# EasyEDA Pro project SMPS_V1.epro, schematic Schematic1
Board Name: Board1; Create Date: 2026-02-03; Page Name: HV PSU; Project Name: TL494-PSU-V1; Schematic Name: Schematic1; Update Date: 2026-02-26; Company: EasyEDA.com; Page Size: A4; Version: V1.0
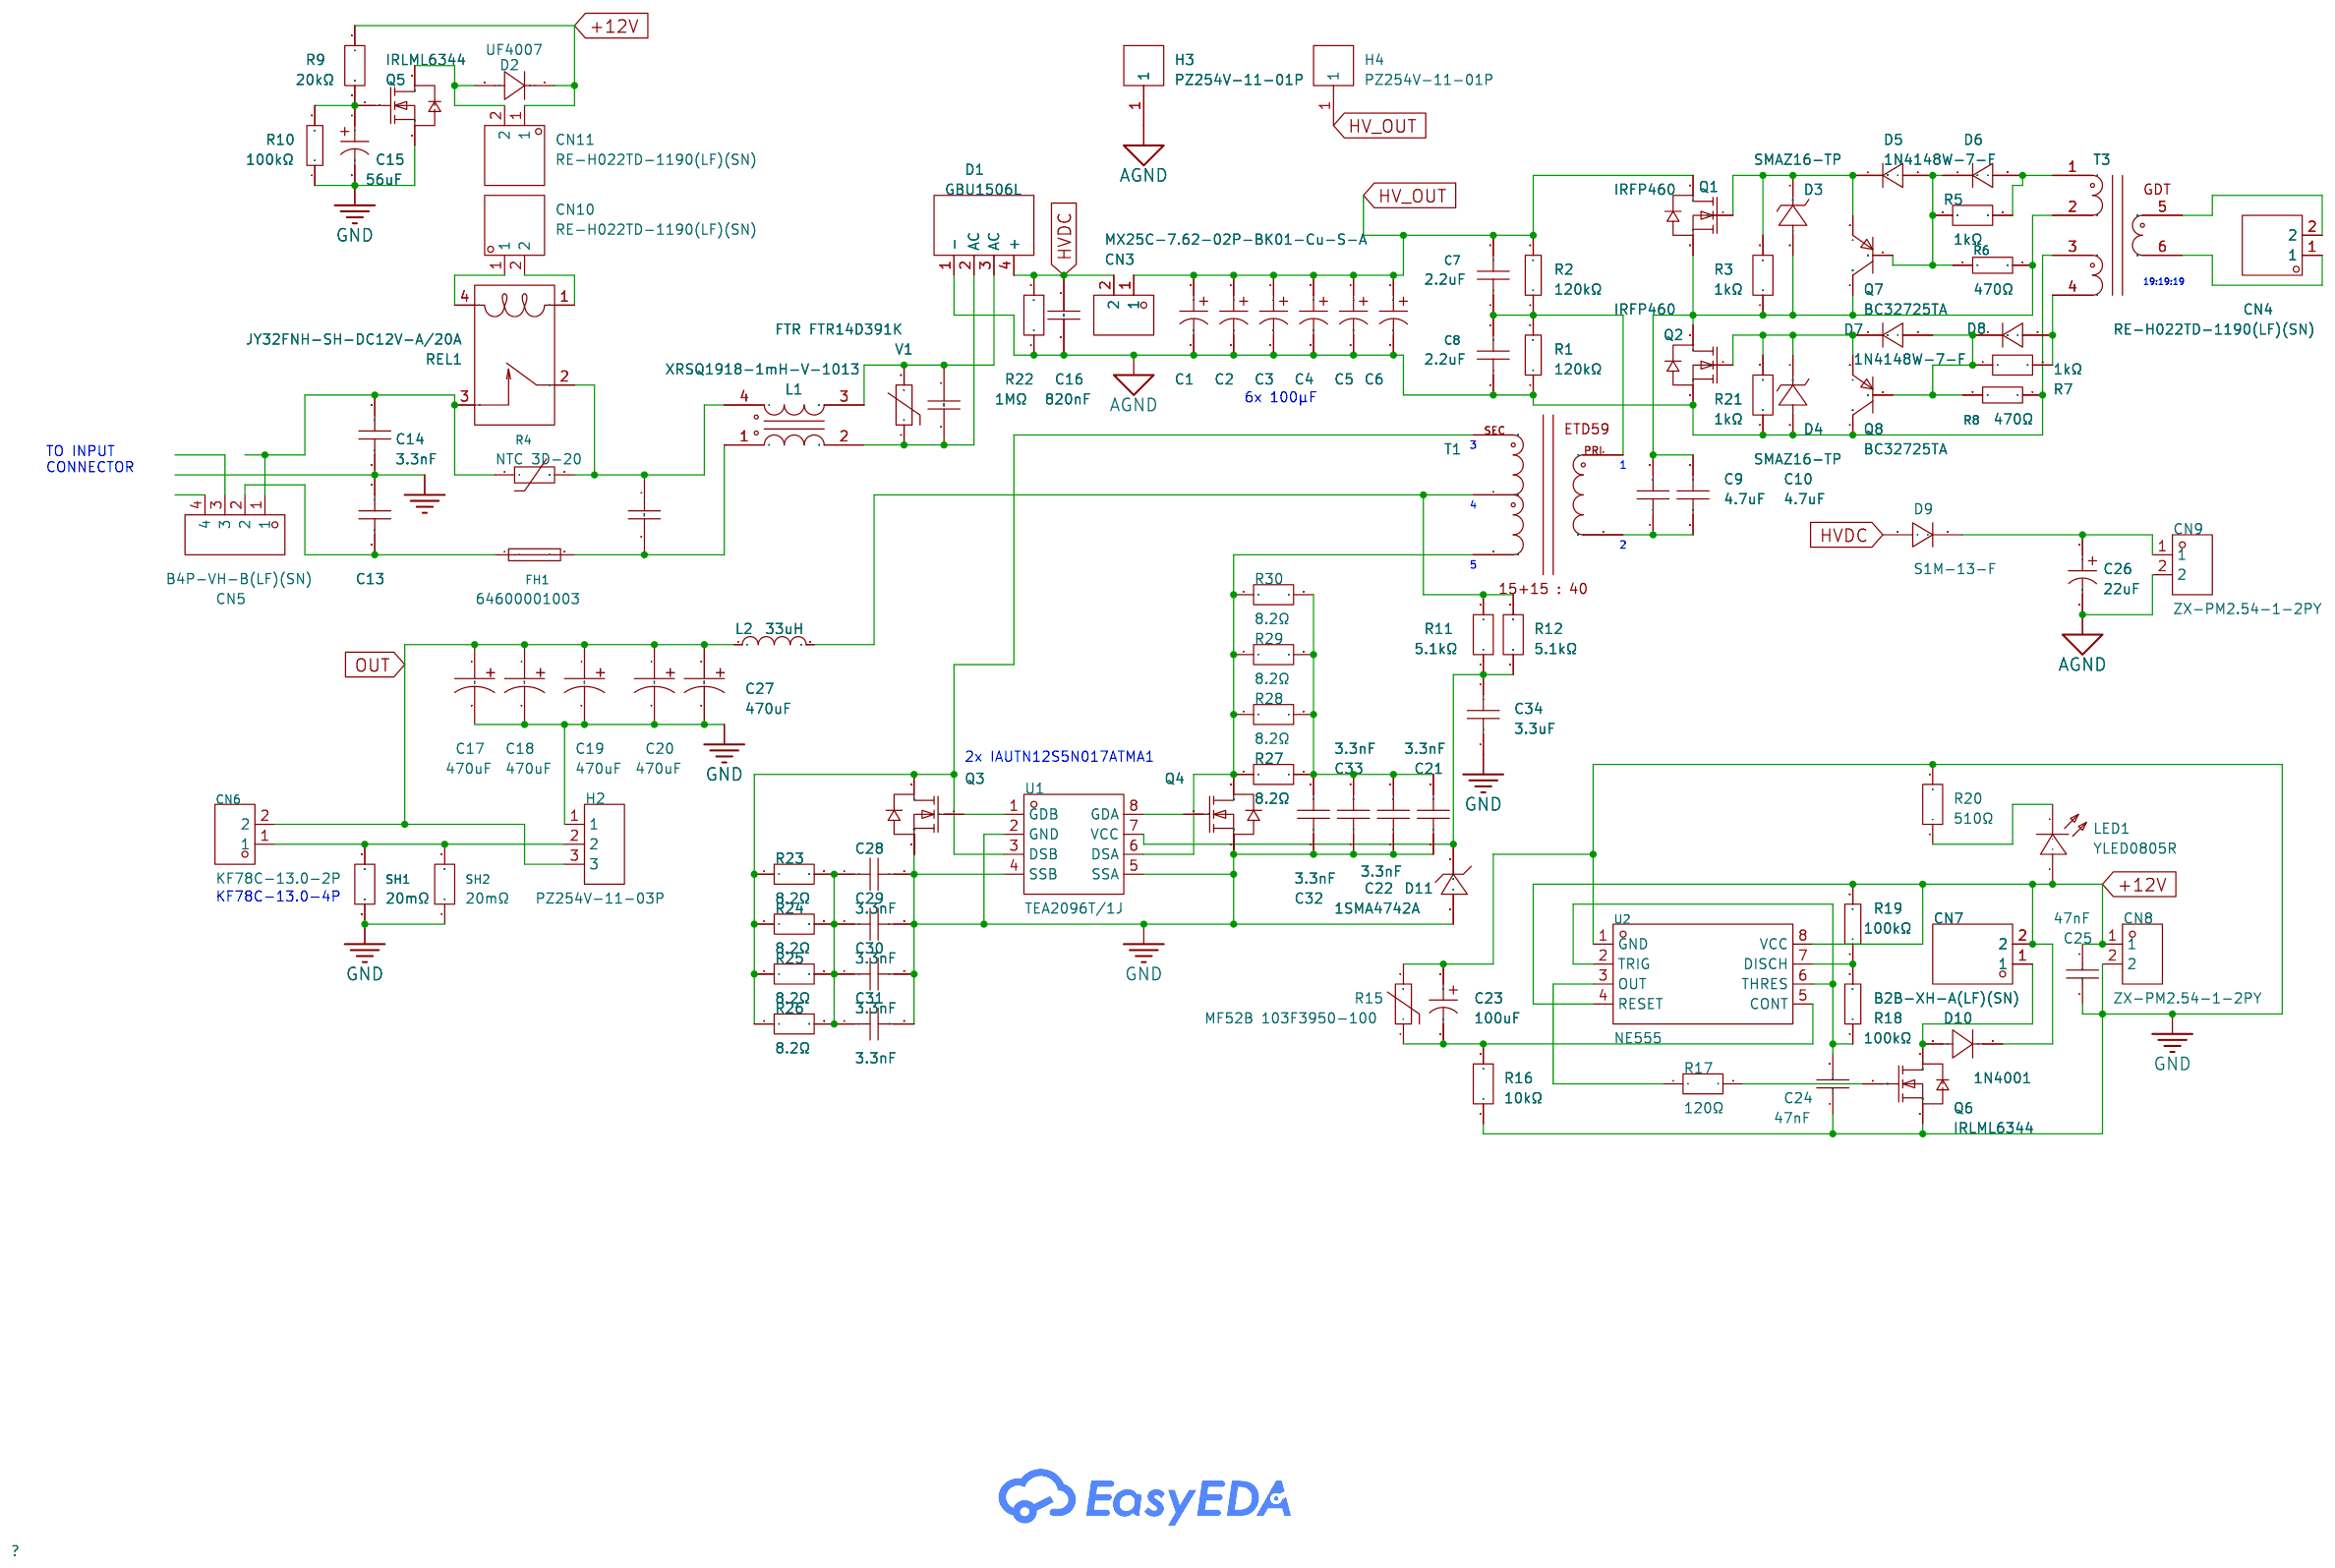
[diagram p1: schematic sheet]

## Parts
C1  100uF  [CAP-TH_BD12.5-P5.00-D0.6-FD]
C2  100uF  [CAP-TH_BD12.5-P5.00-D0.6-FD]
C3  100uF  [CAP-TH_BD12.5-P5.00-D0.6-FD]
C4  100uF  [CAP-TH_BD12.5-P5.00-D0.6-FD]
C5  100uF  [CAP-TH_BD12.5-P5.00-D0.6-FD]
C6  100uF  [CAP-TH_BD12.5-P5.00-D0.6-FD]
C7  2.2uF  [CAP-TH_L17.5-W11.1-P15.00-D1.2]
C8  2.2uF  [CAP-TH_L17.5-W11.1-P15.00-D1.2]
C9  4.7uF  [CAP-TH_L32.0-W15.0-P27.50-D0.8]
C10  4.7uF  [CAP-TH_L32.0-W15.0-P27.50-D0.8]
C11  330nF  [WALSON C42Q333446P40001]
C12  330nF  [WALSON C42Q333446P40001]
C13  3.3nF  [CAP-TH_L10.0-W4.4-P10.00-S3.8-D0.6]
C14  3.3nF  [CAP-TH_L10.0-W4.4-P10.00-S3.8-D0.6]
C15  56uF  [CAP-SMD_L7.3-W4.3-RD]
C16  820nF  [WALSON C42Q382446P60001]
C17  470uF  [CAP-TH_BD16.0-P7.50-D1.2-FD]
C18  470uF  [CAP-TH_BD16.0-P7.50-D1.2-FD]
C19  470uF  [CAP-TH_BD16.0-P7.50-D1.2-FD]
C20  470uF  [CAP-TH_BD16.0-P7.50-D1.2-FD]
C21  3.3nF  [C0805]
C22  3.3nF  [C0805]
C23  100uF  [CAP-SMD_BD6.3-L6.6-W6.6-LS7.4-FD]
C24  47nF  [C0603]
C25  47nF  [C0603]
C26  22uF  [CAP-TH_BD8.0-P3.50-D0.6-FD]
C27  470uF  [CAP-TH_BD16.0-P7.50-D1.2-FD]
C28  3.3nF  [C0805]
C29  3.3nF  [C0805]
C30  3.3nF  [C0805]
C31  3.3nF  [C0805]
C32  3.3nF  [C0805]
C33  3.3nF  [C0805]
C34  3.3uF  [C2220]
CN3  MX25C-7.62-02P-BK01-Cu-S-A  [CONN-TH_2P-P7.62_MAX_MX25C-7.62-BK01-02P-CU-S-A]
CN4  RE-H022TD-1190(LF)(SN)  [HDR-TH_2P-P2.54-V-M-1]
CN5  B4P-VH-B(LF)(SN)  [CONN-TH_4P-P3.96_B4P-VH-B-LF-SN]
CN6  KF78C-13.0-2P  [CONN-TH_KF78C-13.0-2P]
CN7  B2B-XH-A(LF)(SN)  [CONN-TH_B2B-XH-A-LF-SN]
CN8  ZX-PM2.54-1-2PY  [HDR-TH_2P-P2.54-V-F]
CN9  ZX-PM2.54-1-2PY  [HDR-TH_2P-P2.54-V-F]
CN10  RE-H022TD-1190(LF)(SN)  [HDR-TH_2P-P2.54-V-M-1]
CN11  RE-H022TD-1190(LF)(SN)  [HDR-TH_2P-P2.54-V-M-1]
D1  GBU1506L  [GBU_4P-L22.0-W3.5-P5.08]
D2  UF4007  [DO-41_BD2.4-L4.7-P8.70-D0.9-RD]
D3  SMAZ16-TP  [SMA_L4.3-W2.6-LS5.1-RD]
D4  SMAZ16-TP  [SMA_L4.3-W2.6-LS5.1-RD]
D5  1N4148W-7-F  [SOD-123_L2.7-W1.6-LS3.7-RD-1]
D6  1N4148W-7-F  [SOD-123_L2.7-W1.6-LS3.7-RD-1]
D7  1N4148W-7-F  [SOD-123_L2.7-W1.6-LS3.7-RD-1]
D8  1N4148W-7-F  [SOD-123_L2.7-W1.6-LS3.7-RD-1]
D9  S1M-13-F  [SMA_L4.3-W2.6-LS5.2-RD]
D10  1N4001  [SMA_L4.2-W2.6-LS5.0-RD]
D11  1SMA4742A  [SMA_L4.4-W2.8-LS5.4-RD]
FH1  64600001003  [64600001003]
H2  PZ254V-11-03P  [HDR-TH_3P-P2.54-V-M_PZ254V-11-03P]
H3  PZ254V-11-01P  [HDR-TH_1P-P2.54-V-M]
H4  PZ254V-11-01P  [HDR-TH_1P-P2.54-V-M]
L1  XRSQ1918-1mH-V-1013  [FILTER-TH_XRSQ1918-20MH-V-1013]
L2  33uH  [IND-TH_RSEQ32-20UH-47UH]
LED1  YLED0805R  [LED0805-R-RD_RED]
Q1  IRFP460  [TO-247-3_L15.9-W5.1-P5.44-L]
Q2  IRFP460  [TO-247-3_L15.9-W5.1-P5.44-L]
Q3  IAUTN12S5N017ATMA1  [PG-HSOF-8-1_L10.4-W9.9-P1.20-LS11.7-TL]
Q4  IAUTN12S5N017ATMA1  [PG-HSOF-8-1_L10.4-W9.9-P1.20-LS11.7-TL]
Q5  IRLML6344  [SOT-23-3_L3.0-W1.7-P0.95-LS2.9-BR]
Q6  IRLML6344  [SOT-23-3_L3.0-W1.7-P0.95-LS2.9-BR]
Q7  BC32725TA  [TO-92-3_L4.8-W3.7-P2.54-L]
Q8  BC32725TA  [TO-92-3_L4.8-W3.7-P2.54-L]
R1  120kΩ  [RES-TH_BD3.5-L9.5-P13.50-D0.6]
R2  120kΩ  [RES-TH_BD3.5-L9.5-P13.50-D0.6]
R3  1kΩ  [R1206]
R4  NTC 3D-20  [RES-TH_L22.0-W7.0-P7.80-D1.2-S2.00]
R5  1kΩ  [R1206]
R6  470Ω  [R2010]
R7  1kΩ  [R1206]
R8  470Ω  [R2010]
R9  20kΩ  [R1206]
R10  100kΩ  [R1206]
R11  5.1kΩ  [R2512]
R12  5.1kΩ  [R2512]
R15  MF52B 103F3950-100  [RES-TH_BD3.0-P2.00-D0.3]
R16  10kΩ  [R1206]
R17  120Ω  [R1206]
R18  100kΩ  [R1206]
R19  100kΩ  [R1206]
R20  510Ω  [R1206]
R21  1kΩ  [R1206]
R22  1MΩ  [R1206]
R23  8.2Ω  [R2512]
R24  8.2Ω  [R2512]
R25  8.2Ω  [R2512]
R26  8.2Ω  [R2512]
R27  8.2Ω  [R2512]
R28  8.2Ω  [R2512]
R29  8.2Ω  [R2512]
R30  8.2Ω  [R2512]
REL1  JY32FNH-SH-DC12V-A/20A  [RELAY-TH_JY32FNH-S-DCXXV-A-10A]
SH1  20mΩ  [RES-TH_BD1.0-P5.00-D1.0]
SH2  20mΩ  [RES-TH_BD1.0-P5.00-D1.0]
T1  -  [ETD59 - 50A HPWR]  (no BOM)
T3  -  [GDT - HPWR SMPS V1]  (no BOM)
U1  TEA2096T/1J  [SOIC-8_L5.0-W4.0-P1.27-LS6.1-BL]
U2  NE555  [SOIC-8_L4.9-W3.9-P1.27-LS6.0-BL]
V1  -  [RES-TH_L14.0-W5.0-P7.50-D1.0-S2.00]

## Library data of the parts
C1-C6 = KCXL4502W101MF: Capacitance:100uF Tolerance:±20% Tolerance:±20% Voltage Rating:450V Diameter:12.5mm Height - Seated (Max):45mm; LCSC Part Name: 100uF ±20% 450V; Supplier Part: C19193642; Manufacturer: Ymin(永铭); Supplier Footprint: 插件,D12.5xL45mm; JLCPCB Part Class: Extended Part; Supplier: LCSC; Tolerance: ±20%; Voltage Rating: 450V; Diameter: 12.5mm; Height - Seated (Max): 45mm
C7 C8 = ECWFD2W225JC: Capacitance:2.2uF Tolerance:±5% Tolerance:±5% Voltage Rating:450V Operating Temperature:-40℃~+110℃ Operating Temperature:-40℃~+110℃; LCSC Part Name: 2.2uF ±5% 450V; Supplier Part: C178473; Manufacturer: PANASONIC(松下); Supplier Footprint: 插件,P=15mm; JLCPCB Part Class: Extended Part; Datasheet: https://item.szlcsc.com/datasheet/ECWFD2W225JC/189866.html; Supplier: LCSC; Tolerance: ±5%; Voltage Rating: 450V; Operating Temperature: -40℃~+110℃
C9 C10 = C352J475JBSC000: Capacitance:4.7uF Tolerance:±5% Tolerance:±5% Voltage Rating:630V Operating Temperature:-55℃~+105℃ Operating Temperature:-55℃~+105℃; LCSC Part Name: 4.7uF ±5% 630V; Supplier Part: C19189618; Manufacturer: faratronic(厦门法拉); Supplier Footprint: 插件,P=27.5mm; JLCPCB Part Class: Extended Part; Datasheet: https://item.szlcsc.com/datasheet/C352J475JBSC000/20418291.html; Supplier: LCSC; Tolerance: ±5%; Voltage Rating: 630V; Operating Temperature: -55℃~+105℃
C11 C12 = WALSON C42Q333446P40001: Manufacturer: WALSON; Supplier Part: C46638868; Supplier: LCSC; Datasheet: https://www.lcsc.com/datasheet/C46638868.pdf; Part Number: C42Q333446P40001
C13 C14 = CY1332ME1IEF48O2A2: Capacitance:3.3nF Tolerance:±20% Tolerance:±20% Voltage(AC):400V Ratings:Y1 safety certification:CQC；CUL；UL；ENEC；VDE Operating Temperature:-40℃~+125℃ Operating Temperature:-40℃~+125℃; LCSC Part Name: 等级:Y1 3300pF ±20% 400V; Supplier Part: C2761711; Manufacturer: Dersonic(德尔创); Supplier Footprint: 插件,P=10mm; JLCPCB Part Class: Extended Part; Datasheet: https://item.szlcsc.com/datasheet/CY1332ME1IEF48O2A2/2886458.html; Supplier: LCSC; Tolerance: ±20%; Voltage(AC): 400V; Ratings: Y1; safety certification: CQC；CUL；UL；ENEC；VDE; Operating Temperature: -40℃~+125℃
C15 = EEFCX1D560R: Capacitance:56uF Tolerance:±20% Tolerance:±20% Voltage Rating:20V Type:Polymer Diameter:7.3mm Height - Seated (Max):4.3mm Operating Temperature:-55℃~+105℃ Operating Temperature:-55℃~+105℃; LCSC Part Name: 56uF ±20% 20V; Supplier Part: C465937; Manufacturer: PANASONIC(松下); Supplier Footprint: SMD,D7.3xL4.3mm; JLCPCB Part Class: Extended Part; Datasheet: https://item.szlcsc.com/datasheet/EEFCX1D560R/471270.html; Supplier: LCSC; Tolerance: ±20%; Voltage Rating: 20V; Type: Polymer; Diameter: 7.3mm; Height - Seated (Max): 4.3mm; Operating Temperature: -55℃~+105℃
C16 = WALSON C42Q382446P60001: Height: 19mm; Manufacturer: WALSON; Manufacturer Part: C42Q382446P60001; Supplier: LCSC; Supplier Part: C46638880
C17-C20 C27 = ERS1KM471L25OT: Capacitance:470uF Tolerance:±20% Tolerance:±20% Voltage Rating:100V Ripple Current:- Equivalent Series Resistance(ESR):- Pin Spacing:- Diameter:16mm Height - Seated (Max):25mm Lifetime:- Operating Temperature:-40℃~+105℃ Operating Temperature:-40℃~+105℃; LCSC Part Name: 470uF ±20% 100V; Supplier Part: C721247; Manufacturer: AISHI(艾华集团); Supplier Footprint: 插件,D16xL25mm; JLCPCB Part Class: Extended Part; Datasheet: https://item.szlcsc.com/datasheet/ERS1KM471L25OT/764996.html; Supplier: LCSC; Tolerance: ±20%; Voltage Rating: 100V; Diameter: 16mm; Height - Seated (Max): 25mm; Operating Temperature: -40℃~+105℃
C21 C22 C28-C33 = C2012C0G2E332JT000N: Capacitance:3.3nF Tolerance:±5% Tolerance:±5% Voltage Rating:250V Temperature Coefficient:C0G; LCSC Part Name: 3.3nF ±5% 250V; Supplier Part: C43052556; Manufacturer: TDK; Supplier Footprint: 0805; JLCPCB Part Class: Extended Part; Supplier: LCSC; Tolerance: ±5%; Voltage Rating: 250V; Temperature Coefficient: C0G
C23 = RVT1E101M0605: Capacitance:100uF Tolerance:±20% Tolerance:±20% Voltage Rating:25V Ripple Current:78mA@120Hz Equivalent Series Resistance(ESR):- Diameter:6.3mm Height - Seated (Max):5.4mm Lifetime:2000hrs@105℃ Operating Temperature:-40℃~+105℃ Operating Temperature:-40℃~+; LCSC Part Name: 100uF ±20% 25V; Supplier Part: C2918360; Manufacturer: ROQANG(容强); Supplier Footprint: SMD,D6.3xL5.4mm; JLCPCB Part Class: Extended Part; Supplier: LCSC; Tolerance: ±20%; Voltage Rating: 25V; Ripple Current: 78mA@120Hz; Diameter: 6.3mm; Height - Seated (Max): 5.4mm; Lifetime: 2000hrs@105℃; Operating Temperature: -40℃~+105℃
C24 C25 = CL10B473KB8NNNC: Capacitance:47nF Tolerance:±10% Tolerance:±10% Voltage Rating:50V Temperature Coefficient:X7R; LCSC Part Name: 47nF ±10% 50V; Supplier Part: C1622; Manufacturer: SAMSUNG(三星); Supplier Footprint: 0603; JLCPCB Part Class: Basic Part; Datasheet: https://item.szlcsc.com/datasheet/CL10B473KB8NNNC/1974.html; Supplier: LCSC; Tolerance: ±10%; Voltage Rating: 50V; Temperature Coefficient: X7R
C26 = CD110226M2G0816VFL: Capacitance:22uF Voltage Rating:400V Ripple Current:100mA@120Hz Pin Spacing:3.5mm Diameter:8mm Height - Seated (Max):16mm Lifetime:2000hrs@105℃ Operating Temperature:-40℃~+105℃ Operating Temperature:-40℃~+105℃; LCSC Part Name: 22uF 400V; Supplier Part: C7499973; Manufacturer: HRK(鸿瑞凯电子); Supplier Footprint: 插件,D8xL16mm; JLCPCB Part Class: Extended Part; Datasheet: https://item.szlcsc.com/datasheet/CD110226M2G0816VFL/8575833.html; Supplier: LCSC; Voltage Rating: 400V; Ripple Current: 100mA@120Hz; Pin Spacing: 3.5mm; Diameter: 8mm; Height - Seated (Max): 16mm; Lifetime: 2000hrs@105℃; Operating Temperature: -40℃~+105℃
C34 = FS55X335K251EHG: Capacitance:3.3uF Tolerance:±10% Tolerance:±10% Voltage Rating:250V Temperature Coefficient:X7R; LCSC Part Name: 3.3uF ±10% 250V; Supplier Part: C22370027; Manufacturer: PSA(信昌电陶); Supplier Footprint: 2220; JLCPCB Part Class: Extended Part; Datasheet: https://item.szlcsc.com/datasheet/FS55X335K251EHG/23849131.html; Supplier: LCSC; Tolerance: ±10%; Voltage Rating: 250V; Temperature Coefficient: X7R
CN3 = MX25C-7.62-02P-BK01-Cu-S-A: Barrier Type:2-Side Pitch:7.62mm Number of Positions or Pins:1x2P Mounting Type:Straight Pin Location:Mid Terminal Number of Pins:2P Number of Rows:1 Number of PINs Per Row:2 Screw Specification:M3 Current Rating:15A Voltage Rating (Max):300V Wire Gauge -; LCSC Part Name: 7.62mm 1x2P 直插 中脚 排数:1 每排P数:2; Supplier Part: C5188509; Manufacturer: MAX(迈旭); Supplier Footprint: 插件,P=7.62mm; JLCPCB Part Class: Extended Part; Datasheet: https://item.szlcsc.com/datasheet/MX25C-7.62-02P-BK01-Cu-S-A/5862593.html; Supplier: LCSC; Barrier Type: 2-Side; Pitch: 7.62mm; Number of Positions or Pins: 1x2P; Mounting Type: Straight; Pin Location: Mid Terminal; Number of Pins: 2P; Number of Rows: 1; Number of PINs Per Row: 2; Screw Specification: M3; Current Rating: 15A; Voltage Rating (Max): 300V; Wire Gauge - AWG: 14~22; Wire Gauge - mm2: 1.5; Operating Temperature: -40℃~+105℃; Color: Black
CN4 CN10 CN11 = RE-H022TD-1190(LF)(SN): Pins Structure:1x2P Pitch:2.54mm Mounting Type:Through Hole Number of Pins:2P Number of Rows:1 Number of PINs Per Row:2 Current Rating:3A Contact Material:Brass Operating Temperature:-55℃~+125℃ Operating Temperature:-55℃~+125℃ Voltage Rating:250V Plastic; LCSC Part Name: 1x2P 间距:2.54mm 直插; Supplier Part: C160332; Manufacturer: JST; Supplier Footprint: 插件,P=2.54mm; JLCPCB Part Class: Extended Part; Datasheet: https://item.szlcsc.com/datasheet/RE-H022TD-1190(LF)(SN)/171712.html; Supplier: LCSC; Pins Structure: 1x2P; Pitch: 2.54mm; Mounting Type: Through Hole; Number of Pins: 2P; Number of Rows: 1; Number of PINs Per Row: 2; Current Rating: 3A; Contact Material: Brass; Operating Temperature: -55℃~+125℃; Voltage Rating: 250V; Plastic Material: PBT; Flame Retardant Rating: UL94V-0; Color: Black
CN5 = B4P-VH-B(LF)(SN): Pins Structure:1x4P Pitch:3.96mm Mounting Style:Direct Insert Reference Series:VH Number of Pins:4P Number of Rows:1 Number of PINs Per Row:4 Row Spacing:- Current Rating (Max):10A Contact Material:Brass Contact Plating:Tin Operating Temperature Range:-25; LCSC Part Name: 1x4P 间距:3.96mm 直插 系列:VH; Supplier Part: C493148; Manufacturer: JST; Supplier Footprint: 插件,P=3.96mm; JLCPCB Part Class: Extended Part; Datasheet: https://atta.szlcsc.com/upload/public/pdf/source/20220208/ECAA58BC68B23E29E576C700CFB0AF43.pdf; Supplier: LCSC; Pins Structure: 1x4P; Pitch: 3.96mm; Mounting Style: Direct Insert; Reference Series: VH; Number of Pins: 4P; Number of Rows: 1; Number of PINs Per Row: 4; Current Rating (Max): 10A; Contact Material: Brass; Contact Plating: Tin; Operating Temperature Range: -25℃~+85℃; Rated Voltage (Max): 250V; Plastic Material: Glass Fiber Reinforced PBT; Flame Retardant Rating: UL94V-0; Colour: White; Z-Height of the Board: 9.4mm; X-Length of Bottom Edge on Board (Spacing Line): 15.78mm; Y-Width of Bottom Edge on Board: 8.5mm
CN6 = KF78C-13.0-2P: Barrier Type:With Cover Plate Pitch:13mm Number of Positions or Pins:1x2P Mounting Type:Straight Pin Location:Mid Terminal Number of Pins:2P Number of Rows:1 Number of PINs Per Row:2 Current Rating:40A Voltage Rating (Max):750V Wire Gauge - AWG:10~18 Wire; LCSC Part Name: 13mm 1x2P 直插 中脚 排数:1 每排P数:2; Supplier Part: C707721; Manufacturer: KEFA(科发); Supplier Footprint: 插件,P=13mm; JLCPCB Part Class: Extended Part; Datasheet: https://item.szlcsc.com/datasheet/KF78C-13.0-2P/744930.html; Supplier: LCSC; Barrier Type: With Cover Plate; Pitch: 13mm; Number of Positions or Pins: 1x2P; Mounting Type: Straight; Pin Location: Mid Terminal; Number of Pins: 2P; Number of Rows: 1; Number of PINs Per Row: 2; Current Rating: 40A; Voltage Rating (Max): 750V; Wire Gauge - AWG: 10~18; Wire Gauge - mm2: 6; Operating Temperature: -40℃~+105℃; Color: Black
CN7 = B2B-XH-A(LF)(SN): Pins Structure:1x2P Pitch:2.5mm Mounting Type:Through Hole Reference Series:XH Number of Pins:2P Number of Rows:1 Number of PINs Per Row:2 Row Spacing:- Current Rating:3A Contact Material:Brass Contact Plating:Tin Operating Temperature:-25℃~+85℃ Operating; LCSC Part Name: 1x2P 间距:2.5mm 直插 系列:XH; Supplier Part: C158012; Manufacturer: JST; Supplier Footprint: 插件,P=2.5mm; JLCPCB Part Class: Extended Part; Datasheet: https://item.szlcsc.com/datasheet/B2B-XH-A(LF)(SN)/169360.html; Supplier: LCSC; Pins Structure: 1x2P; Pitch: 2.5mm; Mounting Type: Through Hole; Reference Series: XH; Number of Pins: 2P; Number of Rows: 1; Number of PINs Per Row: 2; Current Rating: 3A; Contact Material: Brass; Contact Plating: Tin; Operating Temperature: -25℃~+85℃; Voltage Rating: 250V; Plastic Material: PA66; Flame Retardant Rating: UL94V-0; Supplementary Features: K Pin; Color: White; Z-Height of the Board: 7mm; X-Length of Bottom Edge on Board (Spacing Line): 7.4mm; Y-Width of Bottom Edge on Board: 5.75mm
CN8 CN9 = ZX-PM2.54-1-2PY: Holes Structure:1x2P Pitch:2.54mm Row Spacing:- Circular Hole / Square Hole:Square Hole Mounting Type:Through Hole Number of Rows:1 Number of Positions:2P Current Rating:3A Voltage Rating (Max):- Holes Direction:Top Insulation Height:8.5mm Contact Materia; LCSC Part Name: 1x2P 间距:2.54mm 直插; Supplier Part: C7499322; Manufacturer: Megastar(兆星); Supplier Footprint: 插件,P=2.54mm; JLCPCB Part Class: Extended Part; Datasheet: https://item.szlcsc.com/datasheet/ZX-PM2.54-1-2PY/8573983.html; Supplier: LCSC; Holes Structure: 1x2P; Pitch: 2.54mm; Circular Hole / Square Hole: Square Hole; Mounting Type: Through Hole; Number of Rows: 1; Number of Positions: 2P; Current Rating: 3A; Holes Direction: Top; Insulation Height: 8.5mm; Contact Material: Brass; Contact Plating: Gold; Operating Temperature: -40℃~+105℃; PIN Length: 3.2mm
D1 = GBU1510_C350460: Forward Voltage (Vf@If):900mV@15A Reverse Voltage (Vr): Rectified Current: Reverse Leakage Current (Ir):5uA@600V Peak Forward Surge Current: Operating Temperature:-55℃~+150℃@(Tj) Operating Temperature:-55℃~+150℃@(Tj); Supplier Part: C49326439; Manufacturer: XUMAO; Supplier Footprint: GBU; JLCPCB Part Class: Extended Part; Datasheet: https://atta.szlcsc.com/upload/public/pdf/source/20190115/C350460_808B5E29F59959D047D79C3B6590DA46.pdf; Supplier: LCSC; Forward Voltage (Vf@If): 900mV@15A; Reverse Leakage Current (Ir): 5uA@600V; Operating Temperature: -55℃~+150℃
D2 = UF4007_C960666: Diode Configuration:- Voltage - Forward(Vf@If):1.7V@1A Voltage - DC Reverse(Vr):1kV Current - Rectified:1A Reverse Leakage Current (Ir):5uA@1kV Reverse Recovery Time (trr):75ns Operating Junction Temperature Range:-50℃~+150℃@(Tj) Operating Junction Temper; LCSC Part Name: 耐压:1kV 电流:1A 反向恢复时间：75ns; Supplier Part: C960666; Manufacturer: MDD(辰达半导体); Supplier Footprint: DO-41; JLCPCB Part Class: Extended Part; Datasheet: https://item.szlcsc.com/datasheet/UF4007/1039942.html; Supplier: LCSC; Voltage - Forward(Vf@If): 1.7V@1A; Voltage - DC Reverse(Vr): 1kV; Current - Rectified: 1A; Reverse Leakage Current (Ir): 5uA@1kV; Reverse Recovery Time (trr): 75ns; Operating Junction Temperature Range: -50℃~+150℃@(Tj); Non-Repetitive Peak Forward Surge Current: 30A
D3 D4 = SMAZ16-TP_C49274893: Diode Configuration:1 Independent Zener Voltage(Nom):16V Reverse Leakage Current (Ir):1uA@12.2V Zener Voltage(Range):15.2V~16.8V Zener Voltage(Range):15.2V~16.8V Pd - Power Dissipation:1.5W Impedance(Zzt):10Ω Operating Junction Temperature Range:-55℃~+150; LCSC Part Name: 16V 1uA@12.2V; Supplier Part: C49274893; Manufacturer: TECH PUBLIC(台舟); Supplier Footprint: SMA; JLCPCB Part Class: Extended Part; Datasheet: https://item.szlcsc.com/datasheet/SMAZ16-TP/51722914.html; Supplier: LCSC; Diode Configuration: 1 Independent; Zener Voltage(Nom): 16V; Reverse Leakage Current (Ir): 1uA@12.2V; Zener Voltage(Range): 15.2V~16.8V; Pd - Power Dissipation: 1.5W; Impedance(Zzt): 10Ω; Operating Junction Temperature Range: -55℃~+150℃
D5-D8 = 1N4148W-7-F: Diode Configuration:Independent Voltage - Forward(Vf@If):1.25V@150mA Voltage - DC Reverse(Vr):100V Current - Rectified:300mA Pd - Power Dissipation:400mW Reverse Leakage Current (Ir):1uA@75V Reverse Recovery Time (trr):4ns Operating Junction Temperature R; LCSC Part Name: 100V 300mA; Supplier Part: C83528; Manufacturer: DIODES(美台); Supplier Footprint: SOD-123; JLCPCB Part Class: Extended Part; Datasheet: https://item.szlcsc.com/datasheet/1N4148W-7-F/84693.html; Supplier: LCSC; Diode Configuration: Independent; Voltage - Forward(Vf@If): 1.25V@150mA; Voltage - DC Reverse(Vr): 100V; Current - Rectified: 300mA; Pd - Power Dissipation: 400mW; Reverse Leakage Current (Ir): 1uA@75V; Reverse Recovery Time (trr): 4ns; Operating Junction Temperature Range: -65℃~+150℃@(Tj); Non-Repetitive Peak Forward Surge Current: 2A
D9 = S1M-13-F: Diode Configuration: Forward Voltage (Vf@If):1.1V@1A Reverse Voltage (Vr): Rectified Current: Reverse Leakage Current:5uA@1kV; LCSC Part Name: 电压:1kV 电流:1A; Supplier Part: C155378; Manufacturer: DIODES(美台); Supplier Footprint: SMA(DO-214AC); JLCPCB Part Class: Extended Part; Datasheet: https://atta.szlcsc.com/upload/public/pdf/source/20191127/C460934_53CB09884FCCA0C915B3DA89ED1AF032.pdf; Supplier: LCSC; Forward Voltage (Vf@If): 1.1V@1A; Reverse Leakage Current: 5uA@1kV
D10 = 1N4001_C2909965: Diode Configuration:Independent Voltage - Forward(Vf@If):1.1V@1A Voltage - DC Reverse(Vr):50V Current - Rectified:1A Reverse Leakage Current (Ir):5uA@50V Non-Repetitive Peak Forward Surge Current:30A Operating Junction Temperature Range:-55℃~+150℃ Operati; Supplier Part: C2909965; Manufacturer: YONGYUTAI(永裕泰); Supplier Footprint: SMA; JLCPCB Part Class: Extended Part; Datasheet: https://item.szlcsc.com/datasheet/1N4001/3188906.html; Supplier: LCSC; Diode Configuration: Independent; Voltage - Forward(Vf@If): 1.1V@1A; Voltage - DC Reverse(Vr): 50V; Current - Rectified: 1A; Reverse Leakage Current (Ir): 5uA@50V; Non-Repetitive Peak Forward Surge Current: 30A; Operating Junction Temperature Range: -55℃~+150℃
D11 = 1SMA4742A_C173481: Diode Configuration:Independent Zener Voltage(Nom):12V Reverse Leakage Current (Ir):5uA Zener Voltage(Range):11.4V~12.6V Zener Voltage(Range):11.4V~12.6V Pd - Power Dissipation:1W Impedance(Zzt):9Ω Operating Junction Temperature Range:-55℃~+150℃ Operating; Supplier Part: C173481; Manufacturer: MDD(辰达半导体); Supplier Footprint: SMA(DO-214AC); JLCPCB Part Class: Extended Part; Datasheet: https://item.szlcsc.com/datasheet/1SMA4742A/184870.html; Supplier: LCSC; Diode Configuration: Independent; Zener Voltage(Nom): 12V; Reverse Leakage Current (Ir): 5uA; Zener Voltage(Range): 11.4V~12.6V; Pd - Power Dissipation: 1W; Impedance(Zzt): 9Ω; Operating Junction Temperature Range: -55℃~+150℃
FH1 = 64600001003: Fuseholder Type:Bracket type Number of Circuits:1 Voltage Rating:250V Current Rating:6.3A Fuse Type:Cylindrical Fuse Diameter (φD):5mm Fuse Length:20mm; LCSC Part Name: 6.3A 250V 支座型; Supplier Part: C206887; Manufacturer: Littelfuse(美国力特); Supplier Footprint: 插件; JLCPCB Part Class: Extended Part; Datasheet: https://item.szlcsc.com/datasheet/64600001003/208006.html; Supplier: LCSC; Fuseholder Type: Bracket type; Number of Circuits: 1; Voltage Rating: 250V; Current Rating: 6.3A; Fuse Type: Cylindrical; Fuse Diameter (φD): 5mm; Fuse Length: 20mm
H2 = PZ254V-11-03P: Pin Structure:1x3P Pitch:2.54mm Row Spacing:- Circluar Pins/Square Pins:Pin Header Mounting Type:Through Hole Number of Rows:1 Number of Pins:3P Current Rating:3A Voltage Rating (Max):250V Length of Mating Pin:6mm Insulation Height:2.5mm Length of End Con; LCSC Part Name: 1x3P 间距:2.54mm 方针 直插; Supplier Part: C2937625; Manufacturer: XFCN(兴飞); Supplier Footprint: 插件,P=2.54mm; JLCPCB Part Class: Extended Part; Datasheet: https://item.szlcsc.com/datasheet/PZ254V-11-03P/3293280.html; Supplier: LCSC; Pin Structure: 1x3P; Pitch: 2.54mm; Circluar Pins/Square Pins: Pin Header; Mounting Type: Through Hole; Number of Rows: 1; Number of Pins: 3P; Current Rating: 3A; Voltage Rating (Max): 250V; Length of Mating Pin: 6mm; Insulation Height: 2.5mm; Length of End Connection Pin: 3mm; Operating Temperature: -40℃~+105℃; Color: Black
H3 H4 = PZ254V-11-01P: Pin Structure:1x1P Pitch:2.54mm Row Spacing:- Circluar Pins/Square Pins:Pin Header Mounting Type:Through Hole Number of Rows:1 Number of Pins:1P Current Rating:- Voltage Rating (Max):- Length of Mating Pin:6mm Insulation Height:2.5mm Length of End Connect; LCSC Part Name: 1x1P 间距:2.54mm 方针 直插; Supplier Part: C492400; Manufacturer: XFCN(兴飞); Supplier Footprint: 插件,P=2.54mm; JLCPCB Part Class: Extended Part; Datasheet: https://item.szlcsc.com/datasheet/PZ254V-11-01P/502956.html; Supplier: LCSC; Pin Structure: 1x1P; Pitch: 2.54mm; Circluar Pins/Square Pins: Pin Header; Mounting Type: Through Hole; Number of Rows: 1; Number of Pins: 1P; Length of Mating Pin: 6mm; Insulation Height: 2.5mm; Length of End Connection Pin: 3mm; Contact Material: Brass; Operating Temperature: -40℃~+105℃; Color: Black
L1 = XRSQ1918-1mH-V-1013: Number of Lines:2 Voltage Withstand:1.5kV Current Rating:10A Inductance @ Frequency:1mH@1kHZ DC Resistance(DCR):20mΩ; LCSC Part Name: SQ1918-1mH  立式 13*10  0.7* 1.5线; Supplier Part: C41368814; Manufacturer: XR(祥如); Supplier Footprint: 插件-4P,24x15mm; JLCPCB Part Class: Extended Part; Datasheet: https://item.szlcsc.com/datasheet/XRSQ1918-1mH-V-1013/43126304.html; Supplier: LCSC; Number of Lines: 2; Voltage Withstand: 1.5kV; Current Rating: 10A; Inductance @ Frequency: 1mH@1kHZ; DC Resistance(DCR): 20mΩ
L2 = RSEQ32-330M: Inductance:33uH Tolerance:±20% Tolerance:±20% Current Rating:40A Current - Saturation(Isat):42A DC Resistance(DCR):0.9mΩ Type:Flat Wire Inductor; LCSC Part Name: 扁线大电流电感; Supplier Part: C37634009; Manufacturer: Ruishen(瑞申电子); Supplier Footprint: 插件,33x31.5mm; JLCPCB Part Class: Extended Part; Datasheet: https://item.szlcsc.com/datasheet/RSEQ32-330M/39358272.html; Supplier: LCSC; Tolerance: ±20%; Current Rating: 40A; Current - Saturation(Isat): 42A; DC Resistance(DCR): 0.9mΩ; Type: Flat Wire Inductor
LED1 = YLED0805R: Emitted Color:Red Forward Voltage (VF):1.8V~2.4V Forward Voltage (VF):1.8V~2.4V Power Dissipation:60mW Forward Current:20mA Dominant Wavelength:615nm~630nm Dominant Wavelength:615nm~630nm Peak Wavelength:645nm Diode Configuration:- Lens Color:- Color Temp; Supplier Part: C19171391; Manufacturer: YONGYUTAI(永裕泰); Supplier Footprint: 0805; JLCPCB Part Class: Extended Part; Datasheet: https://atta.szlcsc.com/upload/public/pdf/source/20231027/AB486D22E6D71BC59190C48A798367E6.pdf; Supplier: LCSC; Emitted Color: Red; Forward Voltage (VF): 1.8V~2.4V; Power Dissipation: 60mW; Forward Current: 20mA; Dominant Wavelength: 615nm~630nm; Peak Wavelength: 645nm; Operating Temperature: -40℃~+85℃
Q1 Q2 = IRFP460_C22389973: LCSC Part Name: N沟道20A 500V; Supplier Part: C22389973; Manufacturer: minos(迈诺斯); Supplier Footprint: TO-247; JLCPCB Part Class: Extended Part; Datasheet: https://atta.szlcsc.com/upload/public/pdf/source/20240425/7FEF0AD281DA18A3AE3A6EE2E867B3B9.pdf; Supplier: LCSC
Q3 Q4 = IAUTN12S5N017ATMA1: Drain to Source Voltage:120V Current - Continuous Drain(Id):314A RDS(on):1.7mΩ@10V Pd - Power Dissipation:358W Gate Threshold Voltage (Vgs(th)):3.6V@270uA Gate Charge(Qg):145nC@10V Input Capacitance(Ciss):10.74nF Reverse Transfer Capacitance (Crss@Vds):68; LCSC Part Name: OptiMos 5 汽车级功率 MOSFET，120 V; Supplier Part: C20190989; Manufacturer: Infineon(英飞凌); Supplier Footprint: HSOF-8-1; JLCPCB Part Class: Extended Part; Datasheet: https://item.szlcsc.com/datasheet/IAUTN12S5N017ATMA1/21516986.html; Supplier: LCSC; Drain to Source Voltage: 120V; Current - Continuous Drain(Id): 314A; RDS(on): 1.7mΩ@10V; Pd - Power Dissipation: 358W; Gate Threshold Voltage (Vgs(th)): 3.6V@270uA; Gate Charge(Qg): 145nC@10V; Input Capacitance(Ciss): 10.74nF; Reverse Transfer Capacitance (Crss@Vds): 68pF; Type: N-Channel; Output Capacitance(Coss): 3.08nF
Q5 Q6 = IRLML6344: Number:One N-channel Drain to Source Voltage:30V Current - Continuous Drain(Id):5A RDS(on):29mΩ@4.5V,5A Pd - Power Dissipation:1.3W Gate Threshold Voltage (Vgs(th)):1.1V Gate Charge(Qg):6.8nC@4.5V Input Capacitance(Ciss):650pF@25V Reverse Transfer Capacit; LCSC Part Name: 1个N沟道 耐压:30V 电流:5A; Supplier Part: C5364313; Manufacturer: Hottech(合科泰); Supplier Footprint: SOT-23; JLCPCB Part Class: Extended Part; Datasheet: https://item.szlcsc.com/datasheet/IRLML6344/6193391.html; Supplier: LCSC; Number: One N-channel; Drain to Source Voltage: 30V; Current - Continuous Drain(Id): 5A; RDS(on): 29mΩ@4.5V,5A; Pd - Power Dissipation: 1.3W; Gate Threshold Voltage (Vgs(th)): 1.1V; Gate Charge(Qg): 6.8nC@4.5V; Input Capacitance(Ciss): 650pF@25V; Reverse Transfer Capacitance (Crss@Vds): 46pF@15V; Operating Temperature: -55℃~+150℃
Q7 Q8 = BC32725TA: type:PNP Current - Collector(Ic):800mA Collector - Emitter Voltage VCEO:45V Pd - Power Dissipation:625mW DC Current Gain:100@100mA,1V DC Current Gain:100@100mA,1V Transition frequency(fT):100MHz Current - Collector Cutoff:100nA Vce Saturation(VCE(sat)):70; LCSC Part Name: PNP 电流:800mA 电压:45V; Supplier Part: C236948; Manufacturer: onsemi(安森美); Supplier Footprint: TO-92-3L; JLCPCB Part Class: Extended Part; Datasheet: https://item.szlcsc.com/datasheet/BC32725TA/236375.html; Supplier: LCSC; type: PNP; Current - Collector(Ic): 800mA; Collector - Emitter Voltage VCEO: 45V; Pd - Power Dissipation: 625mW; DC Current Gain: 100@100mA,1V; Transition frequency(fT): 100MHz; Current - Collector Cutoff: 100nA; Vce Saturation(VCE(sat)): 700mV@500mA,50mA; Operating Temperature: -55℃~+150℃; Emitter-Base Voltage(Vebo): 5V; Number: 1 PNP
R1 R2 = MO1WS-120K±5%-2T52: Type:Metal Oxide Film Resistor Resistance:120kΩ Tolerance:±5% Tolerance:±5% Voltage-Supply(Max):350V Power(Watts):1W Temperature Coefficient:±350ppm/℃ Temperature Coefficient:±350ppm/℃ Operating Temperature:-55℃~+155℃ Operating Temperature:-55℃~+155℃; LCSC Part Name: 金属氧化膜电阻 120kΩ ±5% 1W; Supplier Part: C479440; Manufacturer: VO(翔胜); Supplier Footprint: 插件,D3.5xL9mm; JLCPCB Part Class: Extended Part; Datasheet: https://item.szlcsc.com/datasheet/MO1WS-120K%25C2%25B15%2525-2T52/486809.html; Supplier: LCSC; Type: Metal Oxide Film Resistor; Tolerance: ±5%; Voltage-Supply(Max): 350V; Power(Watts): 1W; Temperature Coefficient: ±350ppm/℃; Operating Temperature: -55℃~+155℃
R3 R5 R7 R21 = ERJ-P08F1001V: Type:Thick Film Resistor Resistance:1kΩ Tolerance:±1% Tolerance:±1% Power(Watts):660mW Voltage-Supply(Max):500V Temperature Coefficient:±100ppm/℃ Temperature Coefficient:±100ppm/℃ Operating Temperature:-55℃~+155℃ Operating Temperature:-55℃~+155℃; LCSC Part Name: 1kΩ ±1% 660mW 厚膜电阻; Supplier Part: C4261071; Manufacturer: PANASONIC(松下); Supplier Footprint: 1206; JLCPCB Part Class: Extended Part; Datasheet: https://item.szlcsc.com/datasheet/ERJ-P08F1001V/4831500.html; Supplier: LCSC; Type: Thick Film Resistor; Tolerance: ±1%; Power(Watts): 660mW; Voltage-Supply(Max): 500V; Temperature Coefficient: ±100ppm/℃; Operating Temperature: -55℃~+155℃
R4 = NTC 3D-20: Resistance @ 25℃:3Ω B Constant (25℃/50℃):2700K B Constant (25℃/75℃):2700K B Constant (25℃/85℃):2700K B Constant (25℃/100℃):2700K Power(Watts):4W B Constant Tolerance:±10% Steady State Current (Max):8A Operating Temperature:-40℃~+200℃ Operating Temperature; Supplier Part: C2841043; Manufacturer: RUILON(瑞隆源); Supplier Footprint: 插件,P=10mm; JLCPCB Part Class: Extended Part; Datasheet: https://item.szlcsc.com/datasheet/NTC%25203D-20/3022351.html; Supplier: LCSC; Resistance @ 25℃: 3Ω; B Constant (25℃/50℃): 2700K; B Constant (25℃/75℃): 2700K; B Constant (25℃/85℃): 2700K; B Constant (25℃/100℃): 2700K; Power(Watts): 4W; B Constant Tolerance: ±10%; Steady State Current (Max): 8A; Operating Temperature: -40℃~+200℃
R6 R8 = RTT20471JTE: Type:Thick Film Resistor Resistance:470Ω Tolerance:±5% Tolerance:±5% Power(Watts):750mW Voltage-Supply(Max):200V Temperature Coefficient:±100ppm/℃ Temperature Coefficient:±100ppm/℃ Operating Temperature:-55℃~+155℃ Operating Temperature:-55℃~+155℃; LCSC Part Name: 厚膜电阻 470Ω ±5% 750mW; Supplier Part: C333406; Manufacturer: RALEC(旺诠); Supplier Footprint: 2010; JLCPCB Part Class: Extended Part; Datasheet: https://item.szlcsc.com/datasheet/RTT20471JTE/312182.html; Supplier: LCSC; Type: Thick Film Resistor; Tolerance: ±5%; Power(Watts): 750mW; Voltage-Supply(Max): 200V; Temperature Coefficient: ±100ppm/℃; Operating Temperature: -55℃~+155℃
R9 = FRC1206F2002TS: Type:Thick Film Resistor Resistance:20kΩ Tolerance:±1% Tolerance:±1% Power(Watts):250mW Voltage-Supply(Max):200V Temperature Coefficient:±100ppm/℃ Temperature Coefficient:±100ppm/℃ Operating Temperature:-55℃~+155℃ Operating Temperature:-55℃~+155℃; LCSC Part Name: 20kΩ ±1% 250mW 厚膜电阻; Supplier Part: C2933636; Manufacturer: FOJAN(富捷); Supplier Footprint: 1206; JLCPCB Part Class: Extended Part; Supplier: LCSC; Type: Thick Film Resistor; Tolerance: ±1%; Power(Watts): 250mW; Voltage-Supply(Max): 200V; Temperature Coefficient: ±100ppm/℃; Operating Temperature: -55℃~+155℃
R10 R18 R19 = RC1206FR-07100KL: Type:Thick Film Resistor Resistance:100kΩ Tolerance:±1% Tolerance:±1% Power(Watts):250mW Voltage-Supply(Max):200V Temperature Coefficient:±100ppm/℃ Temperature Coefficient:±100ppm/℃ Operating Temperature:-55℃~+155℃ Operating Temperature:-55℃~+155℃; LCSC Part Name: 厚膜电阻 100kΩ ±1% 250mW; Supplier Part: C137393; Manufacturer: YAGEO(国巨); Supplier Footprint: 1206; JLCPCB Part Class: Extended Part; Datasheet: https://item.szlcsc.com/datasheet/RC1206FR-07100KL/148709.html; Supplier: LCSC; Type: Thick Film Resistor; Tolerance: ±1%; Power(Watts): 250mW; Voltage-Supply(Max): 200V; Temperature Coefficient: ±100ppm/℃; Operating Temperature: -55℃~+155℃
R11 R12 = FRC2512J512 TS: Type:Thick Film Resistor Resistance:5.1kΩ Tolerance:±5% Tolerance:±5% Power(Watts):1W Voltage-Supply(Max):200V Temperature Coefficient:±100ppm/℃ Temperature Coefficient:±100ppm/℃ Operating Temperature:-55℃~+155℃ Operating Temperature:-55℃~+155℃; LCSC Part Name: 5.1kΩ ±5% 1W 厚膜电阻; Supplier Part: C2934122; Manufacturer: FOJAN(富捷); Supplier Footprint: 2512; JLCPCB Part Class: Extended Part; Supplier: LCSC; Type: Thick Film Resistor; Tolerance: ±5%; Power(Watts): 1W; Voltage-Supply(Max): 200V; Temperature Coefficient: ±100ppm/℃; Operating Temperature: -55℃~+155℃
R15 = MF52B 103F3950-100: Resistance @ 25℃:10kΩ B Constant (25℃/50℃):3950K B Constant (25℃/75℃):- B Constant (25℃/85℃):- B Constant (25℃/100℃):- Power(Watts):50mW B Constant Tolerance:±1% Steady State Current (Max):- Operating Temperature:-55℃~+125℃ Operating Temperature:-55℃~+125; LCSC Part Name: 测温型NTC热敏电阻器; Supplier Part: C394021; Manufacturer: 时恒; JLCPCB Part Class: Extended Part; Datasheet: https://item.szlcsc.com/datasheet/MF52B%2520103F3950-100/372740.html; Supplier: LCSC; Resistance @ 25℃: 10kΩ; B Constant (25℃/50℃): 3950K; Power(Watts): 50mW; B Constant Tolerance: ±1%; Operating Temperature: -55℃~+125℃
R16 = FRC1206F1002TS: Type:Thick Film Resistor Resistance:10kΩ Tolerance:±1% Tolerance:±1% Power(Watts):250mW Voltage-Supply(Max):200V Temperature Coefficient:±100ppm/℃ Temperature Coefficient:±100ppm/℃ Operating Temperature:-55℃~+155℃ Operating Temperature:-55℃~+155℃; LCSC Part Name: 10kΩ ±1% 250mW 厚膜电阻; Supplier Part: C2907370; Manufacturer: FOJAN(富捷); Supplier Footprint: 1206; JLCPCB Part Class: Extended Part; Supplier: LCSC; Type: Thick Film Resistor; Tolerance: ±1%; Power(Watts): 250mW; Voltage-Supply(Max): 200V; Temperature Coefficient: ±100ppm/℃; Operating Temperature: -55℃~+155℃
R17 = FRC1206F1200TS: Type:Thick Film Resistor Resistance:120Ω Tolerance:±1% Tolerance:±1% Power(Watts):250mW Voltage-Supply(Max):200V Temperature Coefficient:±100ppm/℃ Temperature Coefficient:±100ppm/℃ Operating Temperature:-55℃~+155℃ Operating Temperature:-55℃~+155℃; LCSC Part Name: 120Ω ±1% 250mW 厚膜电阻; Supplier Part: C2933584; Manufacturer: FOJAN(富捷); Supplier Footprint: 1206; JLCPCB Part Class: Extended Part; Supplier: LCSC; Type: Thick Film Resistor; Tolerance: ±1%; Power(Watts): 250mW; Voltage-Supply(Max): 200V; Temperature Coefficient: ±100ppm/℃; Operating Temperature: -55℃~+155℃
R20 = FRC1206F5100TS: Type:Thick Film Resistor Resistance:510Ω Tolerance:±1% Tolerance:±1% Power(Watts):250mW Voltage-Supply(Max):200V Temperature Coefficient:±100ppm/℃ Temperature Coefficient:±100ppm/℃ Operating Temperature:-55℃~+155℃ Operating Temperature:-55℃~+155℃; LCSC Part Name: 510Ω ±1% 250mW 厚膜电阻; Supplier Part: C2933720; Manufacturer: FOJAN(富捷); Supplier Footprint: 1206; JLCPCB Part Class: Extended Part; Supplier: LCSC; Type: Thick Film Resistor; Tolerance: ±1%; Power(Watts): 250mW; Voltage-Supply(Max): 200V; Temperature Coefficient: ±100ppm/℃; Operating Temperature: -55℃~+155℃
R22 = RV1206FR-071ML: Type:Thick Film Resistor Resistance:1MΩ Tolerance:±1% Tolerance:±1% Power(Watts):250mW Voltage-Supply(Max):500V Temperature Coefficient:±200ppm/℃ Temperature Coefficient:±200ppm/℃ Operating Temperature:-55℃~+155℃ Operating Temperature:-55℃~+155℃; LCSC Part Name: 厚膜电阻 1MΩ ±1% 250mW; Supplier Part: C706459; Manufacturer: YAGEO(国巨); Supplier Footprint: 1206; JLCPCB Part Class: Extended Part; Datasheet: https://item.szlcsc.com/datasheet/RV1206FR-071ML/742979.html; Supplier: LCSC; Type: Thick Film Resistor; Tolerance: ±1%; Power(Watts): 250mW; Voltage-Supply(Max): 500V; Temperature Coefficient: ±200ppm/℃; Operating Temperature: -55℃~+155℃
R23-R30 = RC2512FK-7W8R2L: Type:Thick Film Resistor Resistance:8.2Ω Tolerance:±1% Tolerance:±1% Power(Watts):2W Voltage-Supply(Max):200V Temperature Coefficient:±200ppm/℃ Temperature Coefficient:±200ppm/℃ Operating Temperature:-55℃~+155℃ Operating Temperature:-55℃~+155℃; LCSC Part Name: 厚膜电阻 8.2Ω ±1% 2W; Supplier Part: C876264; Manufacturer: YAGEO(国巨); Supplier Footprint: 2512; JLCPCB Part Class: Extended Part; Datasheet: https://item.szlcsc.com/datasheet/RC2512FK-7W8R2L/936322.html; Supplier: LCSC; Type: Thick Film Resistor; Tolerance: ±1%; Power(Watts): 2W; Voltage-Supply(Max): 200V; Temperature Coefficient: ±200ppm/℃; Operating Temperature: -55℃~+155℃
REL1 = JY32FNH-SH-DC12V-A/20A: Coil Voltage:12V Contact Form:1 Form A: 1A (SPST-NO) Number of Pins:4 Contact Rating:20A@250VAC Switching Voltage(Max):277V@AC；30V@DC Coil Rated Power:200mW Contact Material:Silver Alloy Switching Current(Max):20A Coil Resistance:720Ω Contact Resistance:1; Supplier Part: C17702416; Manufacturer: JY(杰盈电器); Supplier Footprint: 插件,18.2x10.2mm; JLCPCB Part Class: Extended Part; Datasheet: https://item.szlcsc.com/datasheet/JY32FNH-SH-DC12V-A%252F20A/18840259.html; Supplier: LCSC; Coil Voltage: 12V; Contact Form: 1 Form A: 1A (SPST-NO); Number of Pins: 4; Contact Rating: 20A@250VAC; Switching Voltage(Max): 277V@AC；30V@DC; Coil Rated Power: 200mW; Contact Material: Silver Alloy; Switching Current(Max): 20A; Coil Resistance: 720Ω; Contact Resistance: 100mΩ; Operate Time: 10ms; Release Time: 10ms; Operating Temperature: -40℃~+85℃
SH1 SH2 = Y110-5-20J-t1: Type:Current Sense Resistor Resistance:20mΩ Tolerance:±5% Tolerance:±5% Voltage Rating:- Power(Watts):10W Current Rating:- Temperature Coefficient:- Temperature Coefficient:- Mounting Type:Through Hole; LCSC Part Name: 20mΩ ±5% 10W; Supplier Part: C695785; Manufacturer: yezhan(业展); Supplier Footprint: 插件,P=5mm; JLCPCB Part Class: Extended Part; Datasheet: https://item.szlcsc.com/datasheet/Y110-5-20J-t1/729437.html; Supplier: LCSC; Type: Current Sense Resistor; Tolerance: ±5%; Power(Watts): 10W; Mounting Type: Through Hole
T1 = ETD59 15+15:45 50A HPWR
T3 = GDT - HPWR SMPS V1
U1 = TEA2096T/1J: Supplier Part: C5365715; Manufacturer: NXP(恩智浦); Supplier Footprint: SOIC-8; JLCPCB Part Class: Extended Part; Datasheet: https://www.nxp.com/docs/en/data-sheet/TEA2096T.pdf; Supplier: LCSC
U2 = NE555_C5125085: Supplier Part: C5125085; Manufacturer: IDCHIP(英锐芯); Supplier Footprint: SOP-8; JLCPCB Part Class: Extended Part; Datasheet: https://item.szlcsc.com/datasheet/NE555/5722226.html; Supplier: LCSC
V1 = FTR14D391K: Varistor Voltage:351V~429V Varistor Voltage:351V~429V Clamping Voltage:650V Maximum DC Volts:320V Maximum AC Volts:250V Peak Current:4.5kA Energy:100J Energy:100J Capacitance:-; LCSC Part Name: 钳位电压650V 100焦耳 插件压敏电阻; Supplier Part: C693565; Manufacturer: FTR(乔光电子); Supplier Footprint: 插件,P=7.5mm; JLCPCB Part Class: Extended Part; Datasheet: https://item.szlcsc.com/datasheet/FTR14D391K/725927.html; Supplier: LCSC; Varistor Voltage: 351V~429V; Clamping Voltage: 650V; Maximum DC Volts: 320V; Maximum AC Volts: 250V; Peak Current: 4.5kA; Energy: 100J

## Nets
+12V: C25.2 CN7.2 CN8.1 CN11.1 D2.1(K) D10.1(K) LED1.1(+) R9.1 R19.2 U2.4(RESET) U2.8(VCC)
AGND: C1.2 C2.2 C3.2 C4.2 C5.2 C6.2 C8.1 C16.2 C26.2 CN9.2 D1.1(-) D4.2(A) H3.1 Q2.3(S) Q8.1(C) R1.1 R8.1 R21.1 R22.1 T3.3
GND: C15.2 C17.2 C18.2 C19.2 C20.2 C21.1 C22.1 C23.1 C24.1 C25.1 C27.2 C28.2 C29.2 C30.2 C31.2 C32.1 C33.1 C34.1 CN8.2 D11.2 H2.1 Q3.2(S) Q3.3(S) Q3.4(S) Q3.5(S) Q3.6(S) Q3.7(S) Q3.8(S) Q4.2(S) Q4.3(S) Q4.4(S) Q4.5(S) Q4.6(S) Q4.7(S) Q4.8(S) Q5.2(S) Q6.2(S) R10.1 R15.2 R16.1 R20.2 SH1.1 SH2.1 U1.2(GND) U1.4(SSB) U1.5(SSA) U2.1(GND)
GNDHV: C13.1 C14.2
HV_OUT: C1.1 C2.1 C3.1 C4.1 C5.1 C6.1 C7.2 CN3.1 H4.1 Q1.2(D) R2.2
HVDC: C16.1 CN3.2 D1.4(+) D9.2 R22.2
OUT: C17.1 C18.1 C19.1 C20.1 C27.1 CN6.2 H2.3 L2.1
$1N15941: Q3.9(D) R23.1 R24.1 R25.1 R26.1 T1.3 U1.3(DSB)
$1N17716: L2.2 R11.2 R12.2 T1.4
$1N18138: Q4.9(D) R27.1 R28.1 R29.1 R30.1 T1.5 U1.6(DSA)
$1N23331: CN6.1 H2.2 SH1.2 SH2.2
$1N50810: C11.2 FH1.2 L1.1
$1N50811: C11.1 L1.4 R4.2 REL1.2
$1N50814: C13.2 CN5.2 FH1.1
$1N50815: C14.1 CN5.1 R4.1 REL1.3
$1N50828: C7.1 C8.2 R1.2 R2.1 T1.1
$1N50846: C9.1 C10.1 T1.2
$1N50850: CN4.2 T3.5
$1N50852: CN4.1 T3.6
$1N50854: C12.1 D1.3(AC) L1.3 V1.2
$1N50860: C12.2 D1.2(AC) L1.2 V1.1
$1N53315: CN11.2 D2.2(A) Q5.3(D)
$1N53324: C15.1 Q5.1(G) R9.2 R10.2
$1N53830: Q3.1(G) U1.1(GDB)
$1N53858: Q4.1(G) U1.8(GDA)
$1N63805: C26.1 CN9.1 D9.1
$1N64095: C23.2 R15.1 R16.2 U2.5(CONT)
$1N64171: Q6.1(G) R17.2
$1N64212: R17.1 U2.3(OUT)
$1N64227: C24.2 R18.1 U2.2(TRIG) U2.6(THRES)
$1N64272: R18.2 R19.1 U2.7(DISCH)
$1N64917: LED1.2(-) R20.1
$1N66896: CN7.1 D10.2(A) Q6.3(D)
$1N67501: CN10.1 REL1.4
$1N67506: CN10.2 REL1.1
$1N72247: D5.2(A) D6.1(C) Q7.2(B) R5.1 R6.2
$1N72685: D6.2(A) R5.2 T3.1
$1N72772: D8.2(A) R7.2 T3.4
$1N72777: D4.1(C) D7.1(C) Q2.1(G) Q8.3(E) R21.2
$1N72947: C9.2 C10.2 D3.2(A) Q1.3(S) Q2.2(D) Q7.1(C) R3.1 R6.1 T3.2
$1N72974: D3.1(C) D5.1(C) Q1.1(G) Q7.3(E) R3.2
$1N73008: D7.2(A) D8.1(C) Q8.2(B) R7.1 R8.2
$1N76180: C28.1 C29.1 C30.1 C31.1 R23.2 R24.2 R25.2 R26.2
$1N76318: C21.2 C22.2 C32.2 C33.2 R27.2 R28.2 R29.2 R30.2
$1N76362: C34.2 D11.1 R11.1 R12.1 U1.7(VCC)

Not connected (* = marked no-connect by the designer): CN5 3 4

## Notes on the sheet
- 6x 100μF
- TO INPUT
  CONNECTOR
- 2x IAUTN12S5N017ATMA1
- KF78C-13.0-4P
